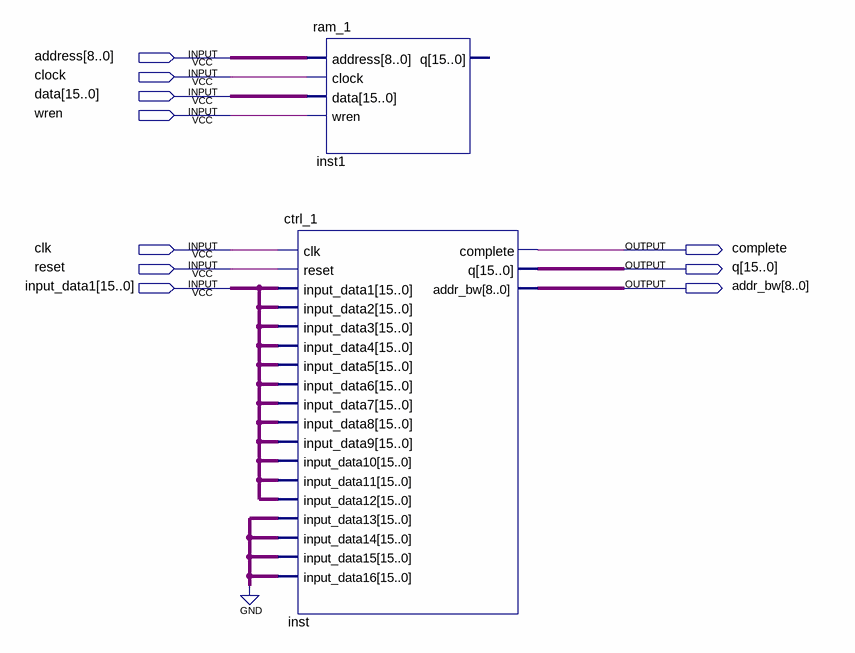
[diagram p0: schematic sheet]
// Quartus schematic ACN.bdf as structural Verilog: 2 symbols, 10 pins
module ACN (
  input  [8:0] address,
  input  clock,
  input  [15:0] data,
  input  wren,
  input  clk,
  input  reset,
  input  [15:0] input_data1,
  output complete,
  output [15:0] q,
  output [8:0] addr_bw
);

  ram_1 inst1 (.address(address), .clock(clock), .data(data), .wren(wren));  // open: q
  ctrl_1 inst (
    .clk(clk), .reset(reset), .input_data1(input_data1), .input_data2(input_data1),
    .input_data3(input_data1), .input_data4(input_data1), .input_data5(input_data1),
    .input_data6(input_data1), .input_data7(input_data1), .input_data8(input_data1),
    .input_data9(input_data1), .input_data10(input_data1), .input_data11(input_data1),
    .input_data12(input_data1), .input_data13({16{1'b0}}), .input_data14({16{1'b0}}),
    .input_data15({16{1'b0}}), .input_data16({16{1'b0}}), .complete(complete), .q(q), .addr_bw(addr_bw));
endmodule
